# Altium schematic sheet SDCARD.SchDoc
size A4
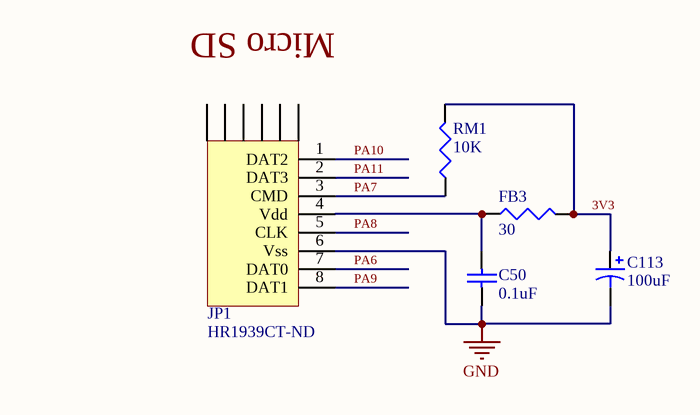
[diagram p0: SDCARD.SchDoc]

## Parts
C50  value 0.1uF  [CAPC2008X06N]  (hidden comment: Kemet_0805_a_0.1uF)
C113  value 100uF  [6032]  (hidden comment: TantCap_6032_100uF)
FB3  Value @ 100MHz: 30  [0805]  (hidden comment: Murata_a_0805_30_Ohm_100Mhz)
JP1  Supplier Part Number 1: HR1939CT-ND  [DM3AT-SF-PEJ]  (hidden comment: MicroSD Connector)
RM1  value 10K  [RES0805]  (hidden comment: Susumu_0805_b2_10K)

## Nets
GND: C50.1 C113.2 JP1.6(Vss)
3V3: C113.1 FB3.2 RM1.2
PA6: JP1.7(DAT0)
PA7: JP1.3(CMD) RM1.1
PA8: JP1.5(CLK)
PA9: JP1.8(DAT1)
PA10: JP1.1(DAT2)
PA11: JP1.2(DAT3)
NetC50_2: C50.2 FB3.1 JP1.4(Vdd)

Not connected (* = marked no-connect by the designer): JP1 C1 C2 C3 C4 C5 C6

## Notes on the sheet
- Micro SD

## Library data of the parts
C50 = Kemet_0805_a_0.1uF: CAP CER 0.1UF 50V 10% X7R 0805; Supplier 1: Digi-Key; Supplier Part Number 1: 399-1170-1-ND
C113 = TantCap_6032_100uF: CAP TANT 100UF 10V 10% LOESR SMD; Code_JEITA: 6032; ComponentLink1Description: Manufacturer Link; ComponentLink1URL: http://www.kemet.com; ComponentLink2Description: Datasheet; ComponentLink2URL: http://www.kemet.com/kemet/web/homepage/kechome.nsf/vapubfiles/B45197A_SpeedPower.pdf/$file/B45197A_SpeedPower.pdf; Supplier 1: Digi-Key; Supplier Part Number 1: 495-1528-1-ND
FB3 = Murata_a_0805_30_Ohm_100Mhz: FERRITE CHIP 30 OHM 3000MA 0805; Supplier 1: Digi-Key; Supplier Part Number 1: 490-1052-1-ND
JP1 = MicroSD Connector: CONN MICRO SD R/A PUSH-PUSH SMD; ComponentLink1Description: Manufacturer Link; ComponentLink1URL: http://www.hirose.com/; ComponentLink2Description: Datasheet; ComponentLink2URL: http://www.hirose.co.jp/cataloge_hp/e60900232.pdf; Supplier 1: Digi-Key
RM1 = Susumu_0805_b2_10K: RES 10.0K OHM 1/10W .5% 0805 SMD; Supplier 1: Digi-Key; Supplier Part Number 1: RR12P10.0KDCT-ND